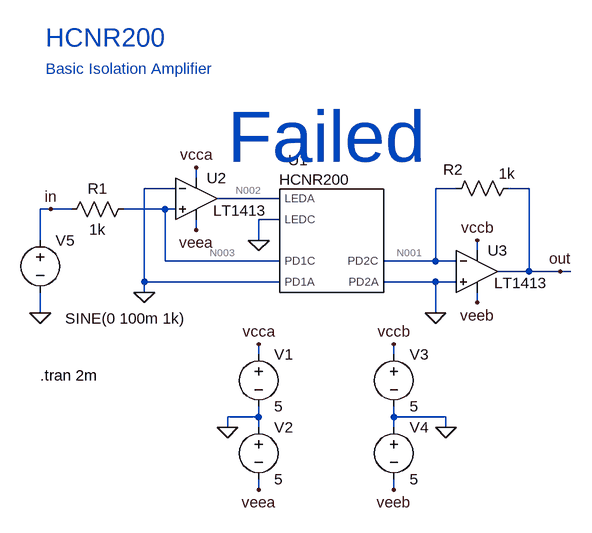
[diagram p0: schematic 02-hcnr200_basic_isolation_amplifier.asc]
02-hcnr200_basic_isolation_amplifier.asc, the LTspice schematic file:
Version 4
SHEET 1 880 724
WIRE 48 112 48 96
WIRE 16 128 -32 128
WIRE 448 128 416 128
WIRE 560 128 528 128
WIRE 176 144 80 144
WIRE -176 160 -192 160
WIRE -144 160 -176 160
WIRE 0 160 -64 160
WIRE 16 160 0 160
WIRE 176 176 144 176
WIRE 48 192 48 176
WIRE -192 208 -192 160
WIRE 144 208 144 176
WIRE 480 224 480 208
WIRE 0 240 0 160
WIRE 176 240 0 240
WIRE 416 240 416 128
WIRE 416 240 336 240
WIRE 448 240 416 240
WIRE 560 256 560 128
WIRE 560 256 512 256
WIRE 608 256 560 256
WIRE 624 256 608 256
WIRE -32 272 -32 128
WIRE 176 272 -32 272
WIRE 416 272 336 272
WIRE 448 272 416 272
WIRE -32 288 -32 272
WIRE 480 304 480 288
WIRE -192 320 -192 288
WIRE 416 320 416 272
WIRE 144 384 144 368
WIRE 352 384 352 368
WIRE 144 480 144 464
WIRE 144 480 96 480
WIRE 352 480 352 464
WIRE 432 480 352 480
WIRE 96 496 96 480
WIRE 144 496 144 480
WIRE 352 496 352 480
WIRE 432 496 432 480
WIRE 144 592 144 576
WIRE 352 592 352 576
FLAG 96 496 0
FLAG 144 368 vcca
FLAG 48 96 vcca
FLAG 144 208 0
FLAG -192 320 0
FLAG -32 288 0
FLAG 416 320 0
FLAG 432 496 0
FLAG 480 208 vccb
FLAG 608 256 out
FLAG -176 160 in
FLAG 352 368 vccb
FLAG 144 592 veea
FLAG 352 592 veeb
FLAG 48 192 veea
FLAG 480 304 veeb
SYMBOL OpAmps\\LT1413 48 80 R0
WINDOW 3 26 82 Left 2
SYMATTR InstName U2
SYMBOL HCNR200 256 208 R0
SYMATTR InstName U1
SYMBOL voltage 144 368 R0
WINDOW 123 0 0 Left 0
WINDOW 39 0 0 Left 0
SYMATTR InstName V1
SYMATTR Value 5
SYMBOL res -48 144 R90
WINDOW 0 0 56 VBottom 2
WINDOW 3 32 56 VTop 2
SYMATTR InstName R1
SYMATTR Value 1k
SYMBOL voltage -192 192 R0
WINDOW 123 0 0 Left 0
WINDOW 39 0 0 Left 0
WINDOW 3 38 136 Left 2
SYMATTR InstName V5
SYMATTR Value SINE(0 100m 1k)
SYMBOL OpAmps\\LT1413 480 192 R0
WINDOW 3 26 82 Left 2
SYMATTR InstName U3
SYMBOL res 544 112 R90
WINDOW 0 3 101 VBottom 2
WINDOW 3 -22 18 VTop 2
SYMATTR InstName R2
SYMATTR Value 1k
SYMBOL voltage 352 368 R0
WINDOW 123 0 0 Left 0
WINDOW 39 0 0 Left 0
SYMATTR InstName V3
SYMATTR Value 5
SYMBOL voltage 144 480 R0
WINDOW 123 0 0 Left 0
WINDOW 39 0 0 Left 0
SYMATTR InstName V2
SYMATTR Value 5
SYMBOL voltage 352 480 R0
WINDOW 123 0 0 Left 0
WINDOW 39 0 0 Left 0
SYMATTR InstName V4
SYMATTR Value 5
TEXT -192 416 Left 2 !.tran 2m
TEXT -184 -104 Left 4 ;HCNR200
TEXT 96 48 Left 7 ;Failed
TEXT -184 -56 Left 2 ;Basic Isolation Amplifier

The netlist it stands for:
* 02-hcnr200_basic_isolation_amplifier.asc
XU2 N003 0 vcca veea N002 LT1413  ; pins In+ In- V+ V- OUT
XU1 0 N002 0 N003 0 N001 HCNR200  ; pins LEDC LEDA PD1A PD1C PD2A PD2C
V1 vcca 0 5
R1 N003 in 1k
V5 in 0 SINE(0 100m 1k)
XU3 0 N001 vccb veeb out LT1413  ; pins In+ In- V+ V- OUT
R2 out N001 1k
V3 vccb 0 5
V2 0 veea 5
V4 0 veeb 5
.tran 2m
* HCNR200
* Failed
* Basic Isolation Amplifier
.lib LTC.lib
.lib hcnr200.lib
.backanno
.end

* Results of the author's LTspice run, read from the files saved beside the schematic
* Operating Point, zero values left out:
*   V(n003) = 12 µV
*   V(vcca) = 5 V
*   V(veea) = -5 V
*   V(n002) = 1.688 V
*   V(n001) = -101.4 nV
*   V(vccb) = 5 V
*   V(veeb) = -5 V
*   V(out) = 132.1 mV
*   I(R1) = 12 nA
*   I(R2) = 132.1 µA
*   I(V1) = -27.65 mA
*   I(V5) = 12 nA
*   I(V3) = -419.2 µA
*   I(V2) = -623.4 pA
*   I(V4) = -287.1 µA
*   Ix(u2:1) = -12 nA
*   Ix(u2:2) = -12 nA
*   Ix(u2:3) = 27.65 mA
*   Ix(u2:4) = -616.7 pA
*   Ix(u2:5) = -27.65 mA
*   Ix(u1:1) = -27.65 mA
*   Ix(u1:2) = 27.65 mA
*   Ix(u1:5) = -132.1 µA
*   Ix(u1:6) = 132.1 µA
*   Ix(u3:1) = -12 nA
*   Ix(u3:2) = -12 nA
*   Ix(u3:3) = 419.2 µA
*   Ix(u3:4) = -287.1 µA
*   Ix(u3:5) = -132.1 µA
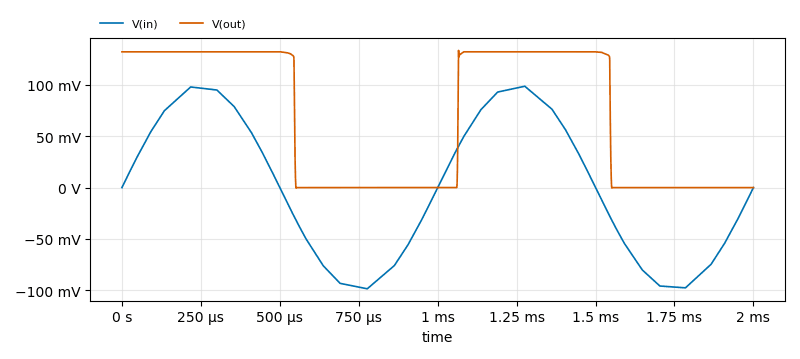
[diagram p1: Transient Analysis of 02-hcnr200_basic_isolation_amplifier.asc, plotted from the saved traces]
* Transient Analysis, 1 run:
*   V(in): min -98.52 mV, max 98.63 mV, average -14.53 µV, rms 69.87 mV, last 0 V
*   V(out): min -474.4 µV, max 133.5 mV, average 67.96 mV, rms 94.6 mV, last -11.99 µV